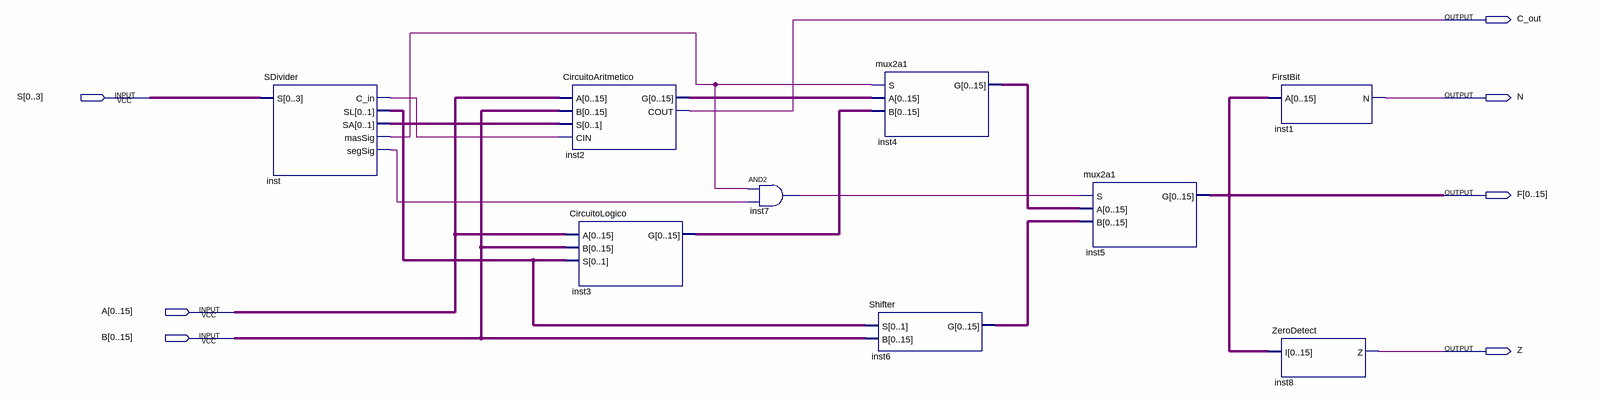
[diagram p0: schematic sheet]
// Quartus schematic Practica4.bdf as structural Verilog: 9 symbols, 7 pins
module Practica4 (
  input  [0:3] S,
  input  [0:15] A,
  input  [0:15] B,
  output C_out,
  output N,
  output [0:15] F,
  output Z
);

  wire inst7_out, inst_c_in, inst_massig, inst_segsig;
  wire [1:0] inst_sa, inst_sl;
  wire [15:0] inst2_g, inst3_g, inst4_g, inst6_g;

  SDivider inst (.S(S), .C_in(inst_c_in), .SL(inst_sl), .SA(inst_sa), .masSig(inst_massig), .segSig(inst_segsig));
  CircuitoAritmetico inst2 (.A(A), .B(B), .S(inst_sa), .CIN(inst_c_in), .G(inst2_g), .COUT(C_out));
  CircuitoLogico inst3 (.A(A), .B(B), .S(inst_sl), .G(inst3_g));
  and inst7 (inst7_out, inst_massig, inst_segsig);
  mux2a1 inst4 (.S(inst_massig), .A(inst2_g), .B(inst3_g), .G(inst4_g));
  Shifter inst6 (.S(inst_sl), .B(B), .G(inst6_g));
  mux2a1 inst5 (.S(inst7_out), .A(inst4_g), .B(inst6_g), .G(F));
  FirstBit inst1 (.A(F), .N(N));
  ZeroDetect inst8 (.I(F), .Z(Z));
endmodule
